# EAGLE schematic powerboard (EAGLE 7.7.0)
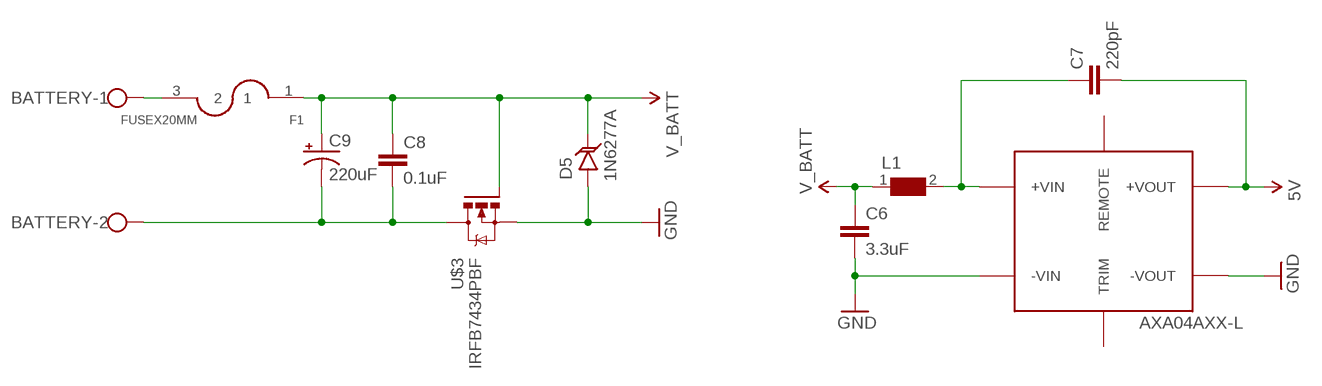
[diagram p0: schematic, sheet 1]

## Parts
BATTERY  W237-102  [W237-102]
C6  3.3uF  CAP1210  [1210]
C7  220pF  C-EUC1808  [C1808]
C8  0.1uF  0.1UF-25V-5%(0603)  [0603-CAP]
C9  220uF  CPOL-USG  [PANASONIC_G]
D5  1N6277A  [1N6277A]
F1  FUSEX20MM  [FUSE_5MM]
L1  WE-HCI-744314650_7030/7040/7050  [WE-HCI_7030/7040/7050]
U$2  AXA04AXX-L  [AXA04AXX-L]
U$3  IRFB7434PBF  [IRFB7434PBF]

## Nets
5V: C7.2 U$2.+VOUT
GND: C6.2 D5.A U$2.-VIN U$2.-VOUT U$3.SOURCE(S)
N$10: C7.1 L1.2 U$2.+VIN
N$11: BATTERY.1 F1.3
N$12: BATTERY.2 C8.2 C9.- U$3.DRAIN(D)
V_BATT: C6.1 C8.1 C9.+ D5.C F1.1 L1.1 U$3.GATE(G)
Unconnected: U$2.REMOTE U$2.TRIM/COMMON(TRIM)

## Library data of the parts
BATTERY = con-wago-500:W237-102: WAGO SCREW CLAMP; MPN: 237-102; OC_FARNELL: unknown; OC_NEWARK: 70K9898
C6 = SparkFun-Capacitors:CAP: Capacitor Standard 0603 ceramic capacitor, and 0.1" leaded capacitor.
C7 = resistor:C-EU: CAPACITOR, European symbol
C8 = SparkFun-Capacitors:0.1UF-25V-5%(0603): CAP-08604; PROD_ID: CAP-08604
C9 = rcl:CPOL-US: POLARIZED CAPACITOR, American symbol
D5 = powerboard:1N6277A
F1 = SparkFun-Passives:FUSE
L1 = WE-HCI:WE-HCI: SMD-Flat Wire High Current Inductor WE-HCI - Flat wire coil for lower losses at high frequency ranges - Low leakage field - Extremely low profile design - Current loading up to 40 A - Magnetically shielded -- Graphic cards -- Laptops -- Motherboards -- High current switching regulators -- Polyphase-switching regulators -- industrial computers; MPN: 744314650; OC_FARNELL: 1636198; OC_NEWARK: 08P2581; PACKAGE: 7050; SUPPLIER: Würth Elektronik eiSos GmbH
U$2 = powerboard:AXA04AXX-L
U$3 = powerboard:IRFB7434PBF